# Altium schematic sheet LowPassFilter.SchDoc
size A4
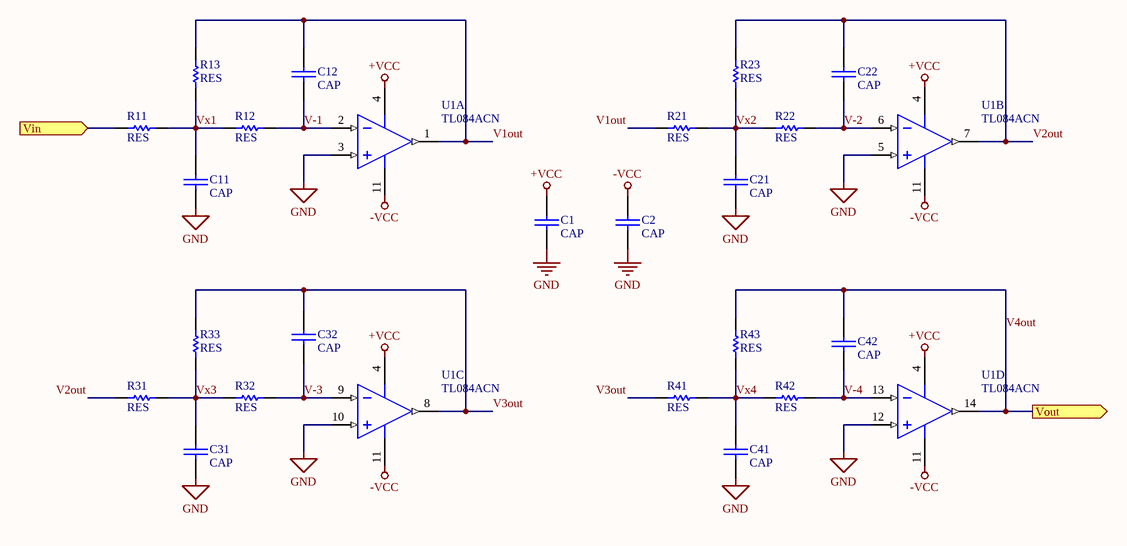
[diagram p0: LowPassFilter.SchDoc]

## Parts
C1  CAP  [CAP200]
C2  CAP  [CAP200]
C11  CAP  [0805]
C12  CAP  [0805]
C21  CAP  [0805]
C22  CAP  [0805]
C31  CAP  [0805]
C32  CAP  [0805]
C41  CAP  [0805]
C42  CAP  [0805]
R11  RES  [0805]
R12  RES  [0805]
R13  RES  [0805]
R21  RES  [0805]
R22  RES  [0805]
R23  RES  [0805]
R31  RES  [0805]
R32  RES  [0805]
R33  RES  [0805]
R41  RES  [0805]
R42  RES  [0805]
R43  RES  [0805]
U1  TL084ACN  [TI-N14]  (parts A,B,C,D of 4)

## Ports
Vin (in), Vout (out)

## Nets
+VCC: C1.1 U1.4(VCC+)
-VCC: C2.1 U1.11(VCC-)
GND: C1.2 C2.2 C11.2 C21.2 C31.2 C41.2 U1.3(IN1+) U1.5(IN2+) U1.10(IN3+) U1.12(IN4+)
V1out: C12.1 R13.1 R21.1 U1.1(OUT1)
V2out: C22.1 R23.1 R31.1 U1.7(OUT2)
V3out: C32.1 R33.1 R41.1 U1.8(OUT3)
V4out: C42.1 R43.1 U1.14(OUT4) ; port Vout
V-1: C12.2 R12.2 U1.2(IN1-)
V-2: C22.2 R22.2 U1.6(IN2-)
V-3: C32.2 R32.2 U1.9(IN3-)
V-4: C42.2 R42.2 U1.13(IN4-)
Vin: R11.1 ; port Vin
Vx1: C11.1 R11.2 R12.1 R13.2
Vx2: C21.1 R21.2 R22.1 R23.2
Vx3: C31.1 R31.2 R32.1 R33.2
Vx4: C41.1 R41.2 R42.1 R43.2

## Library data of the parts
U1 = TL084ACN: JFET-Input Operational Amplifier, 7 to 36 V, 0 to 70 degC, 14-pin DIP (N14), Pb-Free (RoHS); Manufacturer: Texas Instruments; CMRR(Min)(dB): 75; GBW(Typ)(MHz): 3; IIB(Max)(pA): 200; Iq per channel(Max)(mA): 2.8; Number of Channels: 4; Offset Drift(Typ)(uV/C): 18; Rating: Catalog; Slew Rate(Typ)(V/us): 13; Sub Family: General Purpose Amplifier, High Supply Voltage Amplifier (>=30V); Total Supply Voltage(Max)(+5V is 5, +/-5V is 10): 36; Total Supply Voltage(Min)(+5V is 5, +/-5V is 10): 7; Vio (25C)(Max)(mV): 6; DatasheetVersion: SLOS081G; PackageVersion: 4040049/E, 12/2002; PackageReference: N14; PackageDescription: 14-Pin Plastic In-Line, Body 19.305 x 6.35 mm, Pitch 2.54 mm; Supplier 1: Digi-Key; Supplier Part Number 1: 296-1782-5-ND; Supplier 2: Farnell; Supplier Part Number 2: 1106129; Supplier 3: Newark; Supplier Part Number 3: 08F9361; Supplier 4: Mouser; Supplier Part Number 4: 595-TL084ACN; Eco-Plan: Pb-Free (RoHS); Vn at 1kHz(Typ)(nV/rtHz): 18; Mounting Technology: Through Hole; Code_JEDEC: MS-001; PartNumber: TL084ACN; ComponentLink1Description: Manufacturer URL; ComponentLink1URL: http://www.ti.com/; ComponentLink2Description: Datasheet; ComponentLink2URL: http://www.ti.com/lit/ds/symlink/tl084a.pdf; ComponentLink3Description: Package Specification; ComponentLink3URL: http://www.ti.com/lit/ml/mpdi002c/mpdi002c.pdf